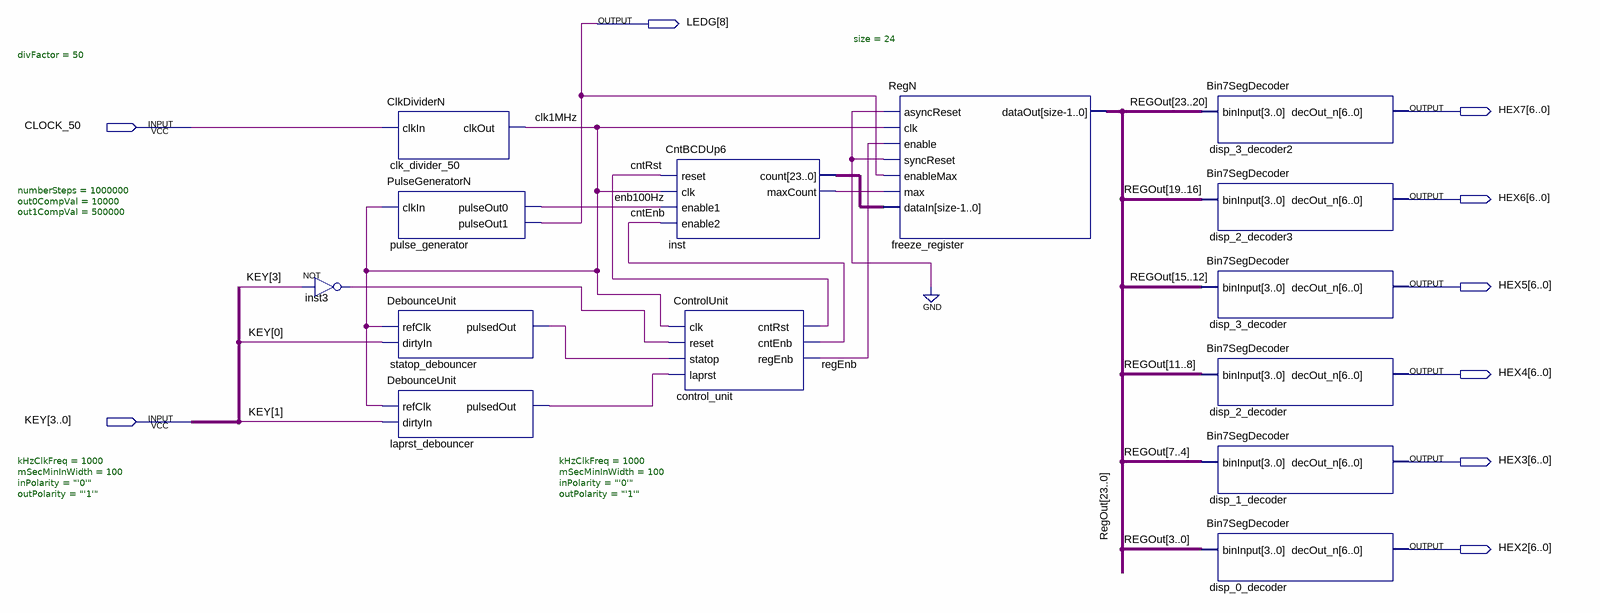
[diagram p0: schematic sheet]
// Quartus schematic Chronometer.bdf as structural Verilog: 14 symbols, 9 pins
module Chronometer (
  input  CLOCK_50,
  input  [3:0] KEY,
  output [8:8] LEDG,
  output [6:0] HEX7,
  output [6:0] HEX6,
  output [6:0] HEX5,
  output [6:0] HEX4,
  output [6:0] HEX3,
  output [6:0] HEX2
);

  wire clk1MHz, cntEnb, cntRst, enb100Hz, inst3_out, inst_maxcount, laprst_debouncer_pulsedout, regEnb,
       statop_debouncer_pulsedout;
  wire [23:0] inst_count, REGOut;

  not inst3 (inst3_out, KEY[3]);
  ClkDividerN #(.divFactor(50)) clk_divider_50 (.clkIn(CLOCK_50), .clkOut(clk1MHz));
  PulseGeneratorN #(.numberSteps(1000000), .out0CompVal(10000), .out1CompVal(500000)) pulse_generator (
    .clkIn(clk1MHz), .pulseOut0(enb100Hz), .pulseOut1(LEDG[8]));
  DebounceUnit #(.kHzClkFreq(1000), .mSecMinInWidth(100), .inPolarity("'0'"), .outPolarity("'1'")) statop_debouncer (
    .refClk(clk1MHz), .dirtyIn(KEY[0]), .pulsedOut(statop_debouncer_pulsedout));
  DebounceUnit #(.kHzClkFreq(1000), .mSecMinInWidth(100), .inPolarity("'0'"), .outPolarity("'1'")) laprst_debouncer (
    .refClk(clk1MHz), .dirtyIn(KEY[1]), .pulsedOut(laprst_debouncer_pulsedout));
  CntBCDUp6 inst (
    .reset(cntRst), .clk(clk1MHz), .enable1(enb100Hz), .enable2(cntEnb), .count(inst_count),
    .maxCount(inst_maxcount));
  ControlUnit control_unit (
    .clk(clk1MHz), .reset(inst3_out), .statop(statop_debouncer_pulsedout),
    .laprst(laprst_debouncer_pulsedout), .cntRst(cntRst), .cntEnb(cntEnb), .regEnb(regEnb));
  RegN #(.size(24)) freeze_register (
    .asyncReset(1'b0), .clk(clk1MHz), .enable(regEnb), .syncReset(1'b0), .enableMax(LEDG[8]),
    .max(inst_maxcount), .dataIn(inst_count), .dataOut(REGOut));
  Bin7SegDecoder disp_3_decoder2 (.binInput(REGOut[23:20]), .decOut_n(HEX7));
  Bin7SegDecoder disp_2_decoder3 (.binInput(REGOut[19:16]), .decOut_n(HEX6));
  Bin7SegDecoder disp_3_decoder (.binInput(REGOut[15:12]), .decOut_n(HEX5));
  Bin7SegDecoder disp_2_decoder (.binInput(REGOut[11:8]), .decOut_n(HEX4));
  Bin7SegDecoder disp_1_decoder (.binInput(REGOut[7:4]), .decOut_n(HEX3));
  Bin7SegDecoder disp_0_decoder (.binInput(REGOut[3:0]), .decOut_n(HEX2));
endmodule
